# Altium schematic sheet Reset.SchDoc
size A4
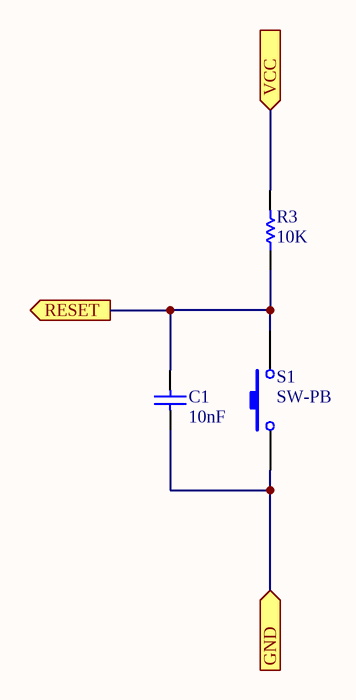
[diagram p0: Reset.SchDoc]

## Parts
C1  10nF  [RAD-0.3]
R3  10K  [AXIAL-0.3]
S1  SW-PB  [SPST-2]

## Ports
GND (in), RESET (out), VCC (in)

## Nets
GND: C1.1 S1.1 ; port GND
RESET: C1.2 R3.1 S1.2 ; port RESET
VCC: R3.2 ; port VCC

## Library data of the parts
C1 = Cap: Capacitor; Published: 8-Jun-2000; LatestRevisionDate: 17-Jul-2002; LatestRevisionNote: Re-released for DXP Platform.; PackageReference: RAD-0.3; Publisher: Altium Limited; PackageDescription: Radial Cap, Thru-Hole; 2 Leads; 0.3 in Pin Spacing; Value: 10nF
R3 = Res1: Resistor; Published: 8-Jun-2000; LatestRevisionDate: 17-Jul-2002; LatestRevisionNote: Re-released for DXP Platform.; PackageReference: AXIAL-0.3; Publisher: Altium Limited; PackageDescription: Axial Device, Thru-Hole; 2 Leads; 0.3 in Pin Spacing; Value: 10K
S1 = SW-PB: Switch; Published: 24-Mar-1999; LatestRevisionDate: 17-Jul-2002; LatestRevisionNote: Re-released for DXP Platform.; PackageReference: SPST-2; Publisher: Altium Limited; PackageDescription: Switch; 2 Leads